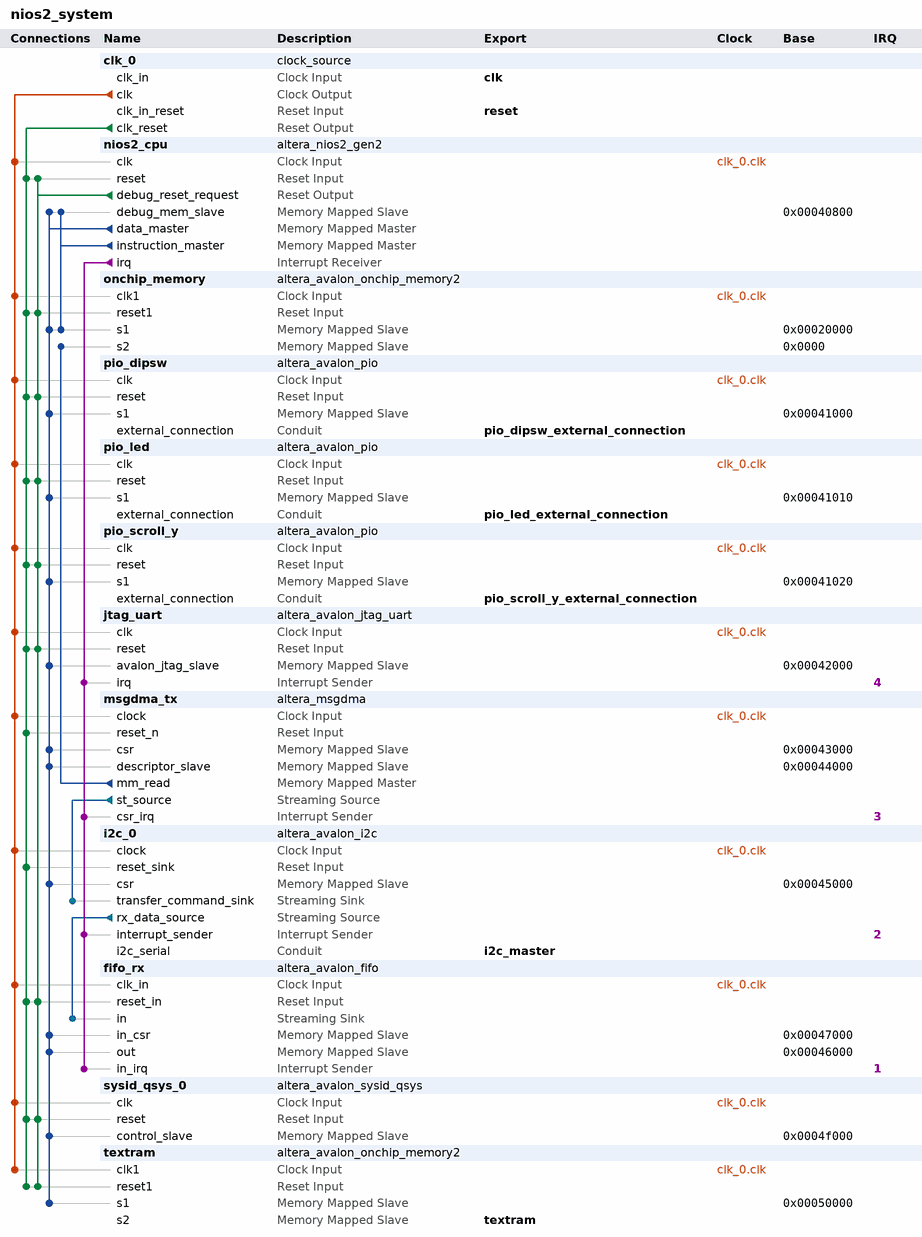
[diagram p0: system contents]
# Platform Designer (Qsys) system nios2_system, Cyclone IV E EP4CE22F17C6
# Parameters at their usual value, and those the tool derives, are not listed.
package require -exact qsys 21.1
create_system nios2_system
set_project_property DEVICE_FAMILY {Cyclone IV E}
set_project_property DEVICE EP4CE22F17C6

add_instance clk_0 clock_source 21.1
set_instance_parameter_value clk_0 clockFrequency 54000000

add_instance nios2_cpu altera_nios2_gen2 21.1
set_instance_parameter_value nios2_cpu dcache_size 2048
set_instance_parameter_value nios2_cpu exceptionSlave onchip_memory.s1
set_instance_parameter_value nios2_cpu icache_size 4096
set_instance_parameter_value nios2_cpu impl Tiny
set_instance_parameter_value nios2_cpu resetSlave onchip_memory.s1

add_instance onchip_memory altera_avalon_onchip_memory2 21.1
set_instance_parameter_value onchip_memory dataWidth 32
set_instance_parameter_value onchip_memory dualPort true
set_instance_parameter_value onchip_memory initMemContent true
set_instance_parameter_value onchip_memory initializationFileName onchip_mem.hex
set_instance_parameter_value onchip_memory memorySize 40960
set_instance_parameter_value onchip_memory singleClockOperation true

add_instance pio_dipsw altera_avalon_pio 21.1
set_instance_parameter_value pio_dipsw captureEdge true
set_instance_parameter_value pio_dipsw direction Input
set_instance_parameter_value pio_dipsw width 4

add_instance pio_led altera_avalon_pio 21.1
set_instance_parameter_value pio_led direction Output
set_instance_parameter_value pio_led width 8

add_instance pio_scroll_y altera_avalon_pio 21.1
set_instance_parameter_value pio_scroll_y captureEdge true
set_instance_parameter_value pio_scroll_y direction Output
set_instance_parameter_value pio_scroll_y width 8

add_instance jtag_uart altera_avalon_jtag_uart 21.1
set_instance_parameter_value jtag_uart simInteractiveOptions NO_INTERACTIVE_WINDOWS

add_instance msgdma_tx altera_msgdma 21.1
set_instance_parameter_value msgdma_tx BURST_ENABLE 0
set_instance_parameter_value msgdma_tx DATA_FIFO_DEPTH 32
set_instance_parameter_value msgdma_tx DATA_WIDTH 16
set_instance_parameter_value msgdma_tx DESCRIPTOR_FIFO_DEPTH 8
set_instance_parameter_value msgdma_tx ENHANCED_FEATURES 0
set_instance_parameter_value msgdma_tx ERROR_ENABLE 0
set_instance_parameter_value msgdma_tx MAX_BURST_COUNT 2
set_instance_parameter_value msgdma_tx MAX_BYTE 1024
set_instance_parameter_value msgdma_tx MODE 1
set_instance_parameter_value msgdma_tx PACKET_ENABLE 0
set_instance_parameter_value msgdma_tx TRANSFER_TYPE {Full Word Accesses Only}
set_instance_parameter_value msgdma_tx USE_FIX_ADDRESS_WIDTH 1

add_instance i2c_0 altera_avalon_i2c 21.1
set_instance_parameter_value i2c_0 FIFO_DEPTH 4
set_instance_parameter_value i2c_0 USE_AV_ST 1

add_instance fifo_rx altera_avalon_fifo 21.1
set_instance_parameter_value fifo_rx bitsPerSymbol 8
set_instance_parameter_value fifo_rx channelWidth 0
set_instance_parameter_value fifo_rx errorWidth 0
set_instance_parameter_value fifo_rx fifoDepth 16
set_instance_parameter_value fifo_rx fifoInputInterfaceOptions AVALONST_SINK
set_instance_parameter_value fifo_rx fifoOutputInterfaceOptions AVALONMM_READ
set_instance_parameter_value fifo_rx singleClockMode true
set_instance_parameter_value fifo_rx symbolsPerBeat 4
set_instance_parameter_value fifo_rx useIRQ true
set_instance_parameter_value fifo_rx usePacket false
set_instance_parameter_value fifo_rx useReadControl false

add_instance sysid_qsys_0 altera_avalon_sysid_qsys 21.1
set_instance_parameter_value sysid_qsys_0 id 0

add_instance textram altera_avalon_onchip_memory2 21.1
set_instance_parameter_value textram dataWidth 8
set_instance_parameter_value textram dualPort true
set_instance_parameter_value textram initMemContent true
set_instance_parameter_value textram initializationFileName onchip_mem.hex
set_instance_parameter_value textram memorySize 8192
set_instance_parameter_value textram singleClockOperation true

# connections
add_connection clk_0.clk fifo_rx.clk_in clock
add_connection clk_0.clk i2c_0.clock clock
add_connection clk_0.clk jtag_uart.clk clock
add_connection clk_0.clk msgdma_tx.clock clock
add_connection clk_0.clk nios2_cpu.clk clock
add_connection clk_0.clk onchip_memory.clk1 clock
add_connection clk_0.clk pio_dipsw.clk clock
add_connection clk_0.clk pio_led.clk clock
add_connection clk_0.clk pio_scroll_y.clk clock
add_connection clk_0.clk sysid_qsys_0.clk clock
add_connection clk_0.clk textram.clk1 clock
add_connection clk_0.clk_reset fifo_rx.reset_in reset
add_connection clk_0.clk_reset i2c_0.reset_sink reset
add_connection clk_0.clk_reset jtag_uart.reset reset
add_connection clk_0.clk_reset msgdma_tx.reset_n reset
add_connection clk_0.clk_reset nios2_cpu.reset reset
add_connection clk_0.clk_reset onchip_memory.reset1 reset
add_connection clk_0.clk_reset pio_dipsw.reset reset
add_connection clk_0.clk_reset pio_led.reset reset
add_connection clk_0.clk_reset pio_scroll_y.reset reset
add_connection clk_0.clk_reset sysid_qsys_0.reset reset
add_connection clk_0.clk_reset textram.reset1 reset
add_connection nios2_cpu.debug_reset_request fifo_rx.reset_in reset
add_connection nios2_cpu.debug_reset_request jtag_uart.reset reset
add_connection nios2_cpu.debug_reset_request nios2_cpu.reset reset
add_connection nios2_cpu.debug_reset_request onchip_memory.reset1 reset
add_connection nios2_cpu.debug_reset_request pio_dipsw.reset reset
add_connection nios2_cpu.debug_reset_request pio_led.reset reset
add_connection nios2_cpu.debug_reset_request pio_scroll_y.reset reset
add_connection nios2_cpu.debug_reset_request sysid_qsys_0.reset reset
add_connection nios2_cpu.debug_reset_request textram.reset1 reset
add_connection msgdma_tx.mm_read onchip_memory.s2 avalon
set_connection_parameter_value msgdma_tx.mm_read/onchip_memory.s2 baseAddress 0x0000
add_connection nios2_cpu.data_master fifo_rx.in_csr avalon
set_connection_parameter_value nios2_cpu.data_master/fifo_rx.in_csr baseAddress 0x00047000
add_connection nios2_cpu.data_master fifo_rx.out avalon
set_connection_parameter_value nios2_cpu.data_master/fifo_rx.out baseAddress 0x00046000
add_connection nios2_cpu.data_master i2c_0.csr avalon
set_connection_parameter_value nios2_cpu.data_master/i2c_0.csr baseAddress 0x00045000
add_connection nios2_cpu.data_master jtag_uart.avalon_jtag_slave avalon
set_connection_parameter_value nios2_cpu.data_master/jtag_uart.avalon_jtag_slave baseAddress 0x00042000
add_connection nios2_cpu.data_master msgdma_tx.csr avalon
set_connection_parameter_value nios2_cpu.data_master/msgdma_tx.csr baseAddress 0x00043000
add_connection nios2_cpu.data_master msgdma_tx.descriptor_slave avalon
set_connection_parameter_value nios2_cpu.data_master/msgdma_tx.descriptor_slave baseAddress 0x00044000
add_connection nios2_cpu.data_master nios2_cpu.debug_mem_slave avalon
set_connection_parameter_value nios2_cpu.data_master/nios2_cpu.debug_mem_slave baseAddress 0x00040800
add_connection nios2_cpu.data_master onchip_memory.s1 avalon
set_connection_parameter_value nios2_cpu.data_master/onchip_memory.s1 baseAddress 0x00020000
add_connection nios2_cpu.data_master pio_dipsw.s1 avalon
set_connection_parameter_value nios2_cpu.data_master/pio_dipsw.s1 baseAddress 0x00041000
add_connection nios2_cpu.data_master pio_led.s1 avalon
set_connection_parameter_value nios2_cpu.data_master/pio_led.s1 baseAddress 0x00041010
add_connection nios2_cpu.data_master pio_scroll_y.s1 avalon
set_connection_parameter_value nios2_cpu.data_master/pio_scroll_y.s1 baseAddress 0x00041020
add_connection nios2_cpu.data_master sysid_qsys_0.control_slave avalon
set_connection_parameter_value nios2_cpu.data_master/sysid_qsys_0.control_slave baseAddress 0x0004f000
add_connection nios2_cpu.data_master textram.s1 avalon
set_connection_parameter_value nios2_cpu.data_master/textram.s1 baseAddress 0x00050000
add_connection nios2_cpu.instruction_master nios2_cpu.debug_mem_slave avalon
set_connection_parameter_value nios2_cpu.instruction_master/nios2_cpu.debug_mem_slave baseAddress 0x00040800
add_connection nios2_cpu.instruction_master onchip_memory.s1 avalon
set_connection_parameter_value nios2_cpu.instruction_master/onchip_memory.s1 baseAddress 0x00020000
add_connection i2c_0.rx_data_source fifo_rx.in avalon_streaming
add_connection msgdma_tx.st_source i2c_0.transfer_command_sink avalon_streaming
add_connection nios2_cpu.irq fifo_rx.in_irq interrupt
set_connection_parameter_value nios2_cpu.irq/fifo_rx.in_irq irqNumber 1
add_connection nios2_cpu.irq i2c_0.interrupt_sender interrupt
set_connection_parameter_value nios2_cpu.irq/i2c_0.interrupt_sender irqNumber 2
add_connection nios2_cpu.irq jtag_uart.irq interrupt
set_connection_parameter_value nios2_cpu.irq/jtag_uart.irq irqNumber 4
add_connection nios2_cpu.irq msgdma_tx.csr_irq interrupt
set_connection_parameter_value nios2_cpu.irq/msgdma_tx.csr_irq irqNumber 3

# exported interfaces
add_interface clk clock sink
set_interface_property clk EXPORT_OF clk_0.clk_in
add_interface i2c_master conduit end
set_interface_property i2c_master EXPORT_OF i2c_0.i2c_serial
add_interface pio_dipsw_external_connection conduit end
set_interface_property pio_dipsw_external_connection EXPORT_OF pio_dipsw.external_connection
add_interface pio_led_external_connection conduit end
set_interface_property pio_led_external_connection EXPORT_OF pio_led.external_connection
add_interface pio_scroll_y_external_connection conduit end
set_interface_property pio_scroll_y_external_connection EXPORT_OF pio_scroll_y.external_connection
add_interface reset reset sink
set_interface_property reset EXPORT_OF clk_0.clk_in_reset
add_interface textram avalon slave
set_interface_property textram EXPORT_OF textram.s2

set_interconnect_requirement {$system} qsys_mm.clockCrossingAdapter HANDSHAKE
set_interconnect_requirement {$system} qsys_mm.enableEccProtection FALSE
set_interconnect_requirement {$system} qsys_mm.insertDefaultSlave FALSE
set_interconnect_requirement {$system} qsys_mm.maxAdditionalLatency 1

save_system nios2_system.qsys
